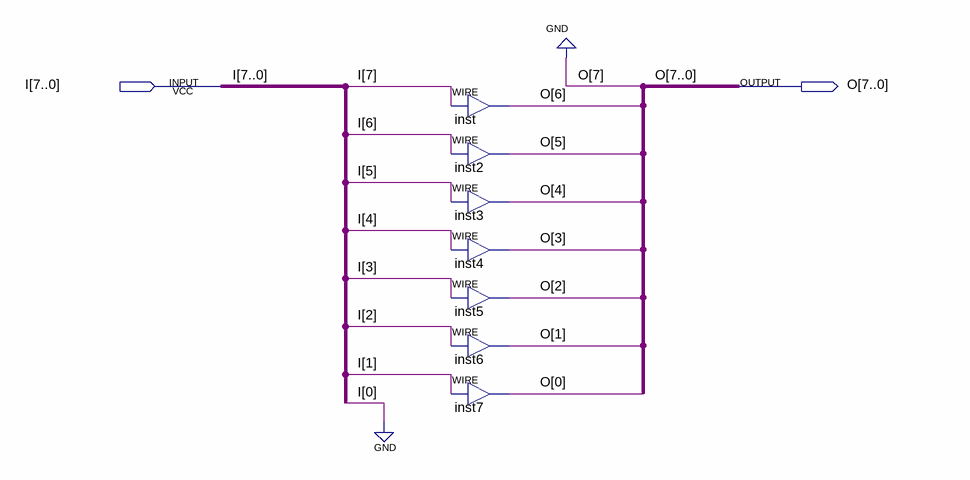
[diagram p0: schematic sheet]
// Quartus schematic Shift-1-Right_8bit.bdf as structural Verilog: 7 symbols, 2 pins
module \Shift-1-Right_8bit  (
  input  [7:0] I,
  output [7:0] O
);

  assign O[6] = I[7];  // WIRE inst
  assign O[5] = I[6];  // WIRE inst2
  assign O[4] = I[5];  // WIRE inst3
  assign O[3] = I[4];  // WIRE inst4
  assign O[2] = I[3];  // WIRE inst5
  assign O[1] = I[2];  // WIRE inst6
  assign O[0] = I[1];  // WIRE inst7

  assign O[7] = 1'b0;
  // also tied to GND on the sheet: I[0]
endmodule
